# EAGLE design LED board (EAGLE 9.2.2)
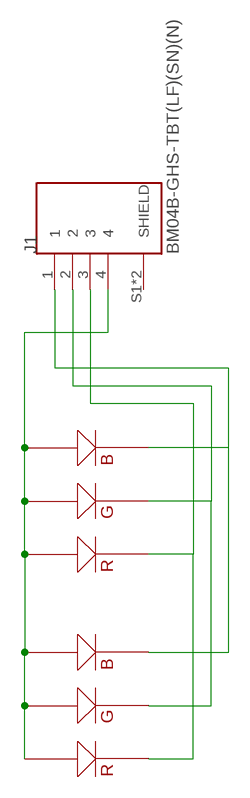
[diagram p0: schematic, sheet 1]

## Parts
J1  BM04B-GHS-TBT(LF)(SN)(N)  [JST_BM04B-GHS-TBT(LF)(SN)(N)]
U$1  3WRGB  [3WRGB]
U$2  3WRGB  [3WRGB]

## Nets
N$1: J1.3 U$1.R- U$2.R-
N$3: J1.2 U$1.G- U$2.G-
N$5: J1.1 U$1.B- U$2.B-
N$6: J1.4 U$1.B+ U$1.G+ U$1.R+ U$2.B+ U$2.G+ U$2.R+
Unconnected: J1.S1(SHIELD) J1.S2(SHIELD)

## Library data of the parts
J1 = BM04B-GHS-TBT_LF__SN__N_:BM04B-GHS-TBT(LF)(SN)(N): Conn Shrouded Header HDR 4 POS 1.25mm Solder ST SMD Reel; AVAILABILITY: Unavailable; DESCRIPTION: Conn Shrouded Header HDR 4 POS 1.25mm Solder ST SMD Reel; MF: JST Sales; MP: BM04B-GHS-TBT_LF__SN__N_; PACKAGE: None; PRICE: None
U$1 U$2 = 3wRGB:3WRGB

## Board
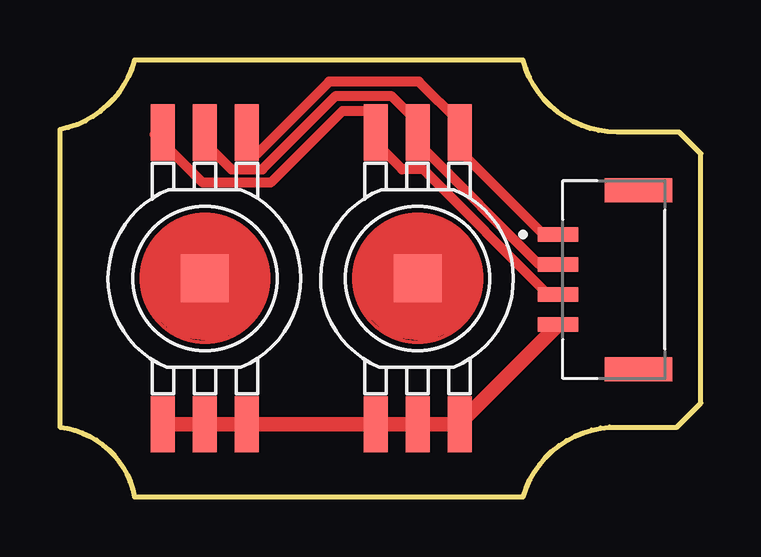
[diagram p1: board, top side]
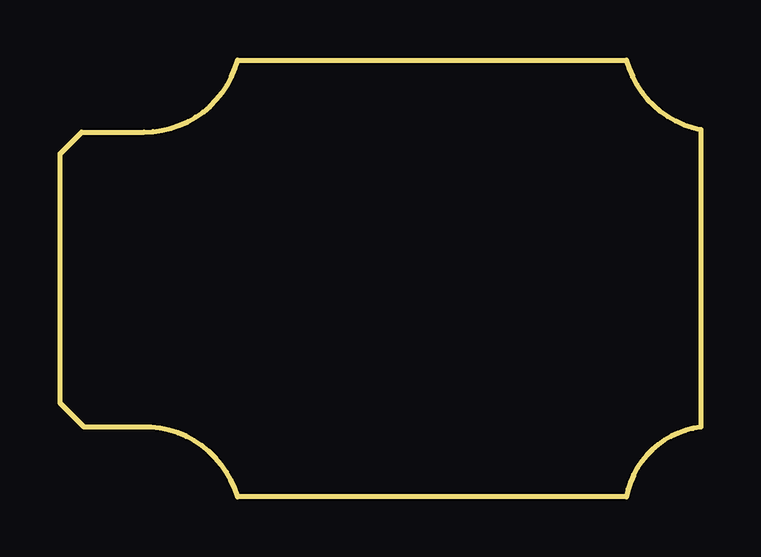
[diagram p2: board, bottom side, seen from below]

Size 26.7 x 18.2 mm. Coordinates in mm from the lower left corner, seen from the top.
Outline: 0,2.9 arc-73 3.1,0 19.3,0 arc-70 22.9,2.9 25.7,2.9 26.7,3.9 26.7,14.3 25.8,15.2 23.2,15.2 arc-76 19.3,18.2 3.1,18.2 arc-64 0,15.3 0,2.9
Copper layers (1*16): Top 0.035mm / dielectric 1.5mm / Bottom 0.035mm
Design rules "default *": minimum track width 6mil, minimum drill 0.35mm, track to track 6mil, track to pad 6mil, pad to pad 6mil, via to via 6mil, smd to smd 6mil, copper to edge 6mil, drill to drill 6mil, minimum pad ring 10mil, minimum via ring 8mil, stop-mask expansion 4mil, vias tented up to drill 0mil, thermal gap 10mil

### Footprints (pad centres in the part's own frame; a part is rotated, then mirrored left to right if it is on the bottom)
JST_BM04B-GHS-TBT(LF)(SN)(N) = smd 0.6 x 1.7: 1 1.875,3.35; 2 0.625,3.35; 3 -0.625,3.35; 4 -1.875,3.35 | smd 1 x 2.8: S1 -3.725,0; S2 3.725,0
3WRGB = smd 2.35 x 1: B+ 6.075,1.75; B- -6.075,1.75; G+ 6.075,0; G- -6.075,0; R+ 6.075,-1.75; R- -6.075,-1.75 | smd 2 x 2: P$1 0,0

### Placement (x,y rotation side)
J1  24.1,9.05 90 top
U$1  6.04,9.1 270 top
U$2  14.9,9.1 270 top

### Tracks (layer width: path | path; a pad name or v marks a point on that pad's centre or on a via)
N$1
  Top 0.406: J1.3 20.35,8.42 15.13,13.64 14.25,13.64 13.26,14.64 13.26,15.57 12.75,16.07 11.77,16.07 8.78,13.09 5.95,13.09 3.95,15.09
N$3
  Top 0.406: J1.2 19.97,9.67 15.07,14.58 15.07,14.63 15,14.7 15,15.07 U$2.G- 14.9,15.6 13.8,16.71 11.5,16.71 8.44,13.64 7.14,13.64 6.04,14.75 U$1.G-
N$5
  Top 0.406: J1.1 20.15,10.92 16.65,14.43 16.65,15.6 14.95,17.3 11.21,17.3 8.19,14.27 7.79,14.68 U$1.B- 7.79,14.59 7.6,14.4
N$6
  Top 0.2: 20.75,7.12 J1.4
  Top 0.61: J1.4 16.65,3.07 U$2.B+ U$2.G+ U$2.R+ U$1.B+ U$1.G+ U$1.R+